# EAGLE design Nixie2nd_ver1 (EAGLE 9.6.2)
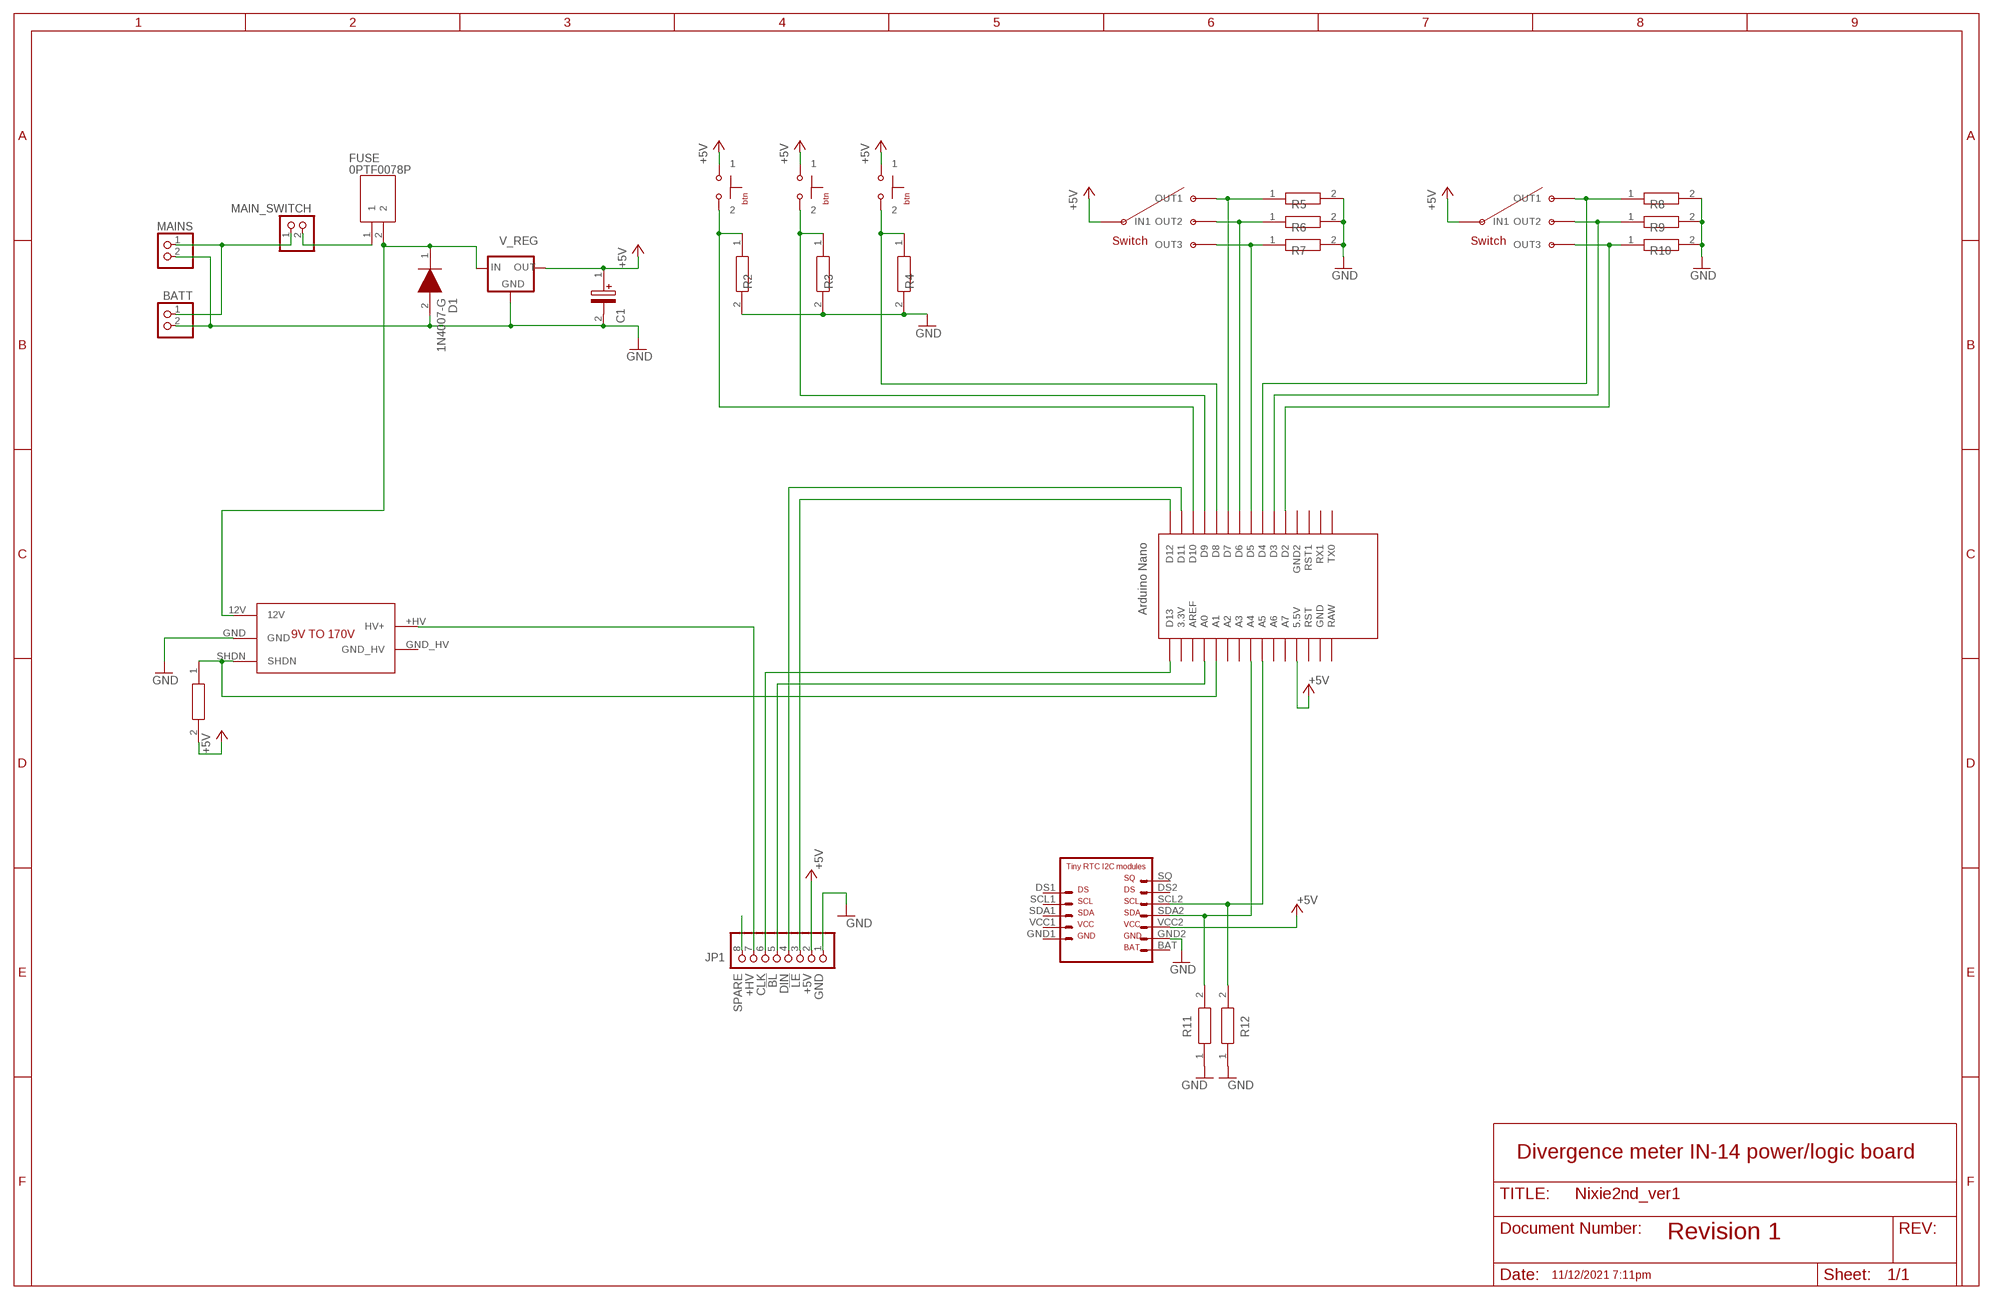
[diagram p0: schematic, sheet 1]

## Parts
BATT  PINHD-1X2  [1X02]
BTN_1  PUSH_BTN  [PUSH_BTN]
BTN_2  PUSH_BTN  [PUSH_BTN]
BTN_3  PUSH_BTN  [PUSH_BTN]
C1  ESMG250ELL330ME11D  [CAPPRD275W60D825H1300]
D1  1N4007-G  [DIOAD1410W90L470D235]
FUSE  0PTF0078P  [0PTF0078P]
JP1  PINHD-1X8  [1X08]
MAIN_SWITCH  PINHD-1X2  [1X02]
MAINS  PINHD-1X2  [1X02]
R1  CR0805-FX-3303ELF  [RESC2012X60N]
R2  CR0805-FX-3303ELF  [RESC2012X60N]
R3  CR0805-FX-3303ELF  [RESC2012X60N]
R4  CR0805-FX-3303ELF  [RESC2012X60N]
R5  CR0805-FX-3303ELF  [RESC2012X60N]
R6  CR0805-FX-3303ELF  [RESC2012X60N]
R7  CR0805-FX-3303ELF  [RESC2012X60N]
R8  CR0805-FX-3303ELF  [RESC2012X60N]
R9  CR0805-FX-3303ELF  [RESC2012X60N]
R10  CR0805-FX-3303ELF  [RESC2012X60N]
R11  CR0805-FX-3303ELF  [RESC2012X60N]
R12  CR0805-FX-3303ELF  [RESC2012X60N]
SWITCH_1  3WAY_SWITCH  [3WAY_SWITCH]
SWITCH_2  3WAY_SWITCH  [3WAY_SWITCH]
U$1  NANO  [NANO]
U$2  VOLTAGE_9TO170VOLT_9TO170  [VOLTAGE_9TO170]
U$3  RTC  [RTC]
V_REG  78XXS  [78XXS]

## Nets
!BL: JP1.5 U$1.A0
!LE: JP1.3 U$1.D12
+5V: BTN_1.1 BTN_2.1 BTN_3.1 C1.1(+) JP1.2 R1.2 SWITCH_1.IN1 SWITCH_2.IN1 U$1.5V(5.5V) U$3.VCC2 V_REG.OUT
+HV: JP1.7 U$2.+HV(HV+)
CLK: JP1.6 U$1.D13
DIN: JP1.4 U$1.D11
GND: BATT.2 C1.2(-) D1.2(A) JP1.1 MAINS.2 R2.2 R3.2 R4.2 R5.2 R6.2 R7.2 R8.2 R9.2 R10.2 R11.1 R12.1 U$2.GND U$3.GND2 V_REG.GND
MAINS: BATT.1 MAIN_SWITCH.1 MAINS.1
MAINS_REG: D1.1(K) FUSE.2 U$2.12V V_REG.IN
N$1: R5.1 SWITCH_1.OUT1 U$1.D7
N$2: R6.1 SWITCH_1.OUT2 U$1.D6
N$3: R7.1 SWITCH_1.OU3(OUT3) U$1.D5
N$4: R8.1 SWITCH_2.OUT1 U$1.D4
N$5: R9.1 SWITCH_2.OUT2 U$1.D3
N$6: R10.1 SWITCH_2.OU3(OUT3) U$1.D2
N$7: BTN_3.2 R4.1 U$1.D8
N$8: BTN_2.2 R3.1 U$1.D9
N$9: BTN_1.2 R2.1 U$1.D10
N$15: FUSE.1 MAIN_SWITCH.2
SCL: R12.2 U$1.A5 U$3.SCL2
SDA: R11.2 U$1.A4 U$3.SDA2
SHDN: R1.1 U$1.A1 U$2.SHDN
SPARE: JP1.8
Unconnected: U$1.3.3V U$1.A2 U$1.A3 U$1.A6 U$1.A7 U$1.AREF U$1.GND U$1.GND1(GND2) U$1.RAW U$1.RST U$1.RST1 U$1.RX1 U$1.TX0 U$2.GND_HV U$3.BAT U$3.DS1 U$3.DS2 U$3.GND1 U$3.SCL1 U$3.SDA1 U$3.SQ U$3.VCC1

## Notes on the sheet
- Divergence meter IN-14 power/logic board
- Revision 1
- 11/12/2021 7:11pm

## Library data of the parts
BATT MAIN_SWITCH MAINS = pinhead:PINHD-1X2: PIN HEADER
BTN_1-BTN_3 = my_libary:PUSH_BTN
C1 = SamacSys_Parts:ESMG250ELL330ME11D: Aluminium Electrolytic Capacitors - Radial Leaded 33uF 25 Volt Source: Datasheet <https://componentsearchengine.com/Datasheets/1/ESMG250ELL330ME11D.pdf>; DESCRIPTION: Aluminium Electrolytic Capacitors - Radial Leaded 33uF 25 Volt; HEIGHT: 13mm; MANUFACTURER_NAME: United Chemi-Con; MANUFACTURER_PART_NUMBER: ESMG250ELL330ME11D; MOUSER_PART_NUMBER: 661-ESMG250L330ME11D; MOUSER_PRICE-STOCK: https://www.mouser.com/Search/Refine.aspx?Keyword=661-ESMG250L330ME11D
D1 = SamacSys_Parts:1N4007-G: Rectifiers 1A 1000V Source: Datasheet <https://datasheet.datasheetarchive.com/originals/distributors/Datasheets-DGA23/1390217.pdf>; DESCRIPTION: Rectifiers 1A 1000V; HEIGHT: mm; MANUFACTURER_NAME: Comchip Technology; MANUFACTURER_PART_NUMBER: 1N4007-G; MOUSER_PART_NUMBER: 750-1N4007-G; MOUSER_PRICE-STOCK: https://www.mouser.co.uk/ProductDetail/Comchip-Technology/1N4007-G?qs=2qJf6qQ4IOKzApuByvlhjQ%3D%3D
FUSE = SamacSys_Parts:0PTF0078P: FUSEHOLDER-OPEN 5X20MM UL94V0 PITCH 22/6 Source: Datasheet <https://media.digikey.com/pdf/Data Sheets/Littelfuse PDFs/PTF075_77_78.pdf>; DESCRIPTION: FUSEHOLDER-OPEN 5X20MM UL94V0 PITCH 22/6; HEIGHT: 11.5mm; MANUFACTURER_NAME: LITTELFUSE; MANUFACTURER_PART_NUMBER: 0PTF0078P; MOUSER_PART_NUMBER: 576-0PTF0078P; MOUSER_PRICE-STOCK: https://www.mouser.co.uk/ProductDetail/Littelfuse/0PTF0078P?qs=Co4VkB5J4%2Fsczy6gG8s%2FsA%3D%3D
JP1 = pinhead:PINHD-1X8: PIN HEADER
R1-R12 = SamacSys_Parts:CR0805-FX-3303ELF: Thick Film Resistors - SMD 330K 1%.330 kOhms +/-1% 0.125W, 1/8W Chip Resistor 0805 (2012 Metric) Moisture Resistant Thick Film Source: Datasheet <https://www.bourns.com/pdfs/chpreztr.pdf>; DESCRIPTION: Thick Film Resistors - SMD 330K 1%.330 kOhms +/-1% 0.125W, 1/8W Chip Resistor 0805 (2012 Metric) Moisture Resistant Thick Film; HEIGHT: 0.6mm; MANUFACTURER_NAME: Bourns; MANUFACTURER_PART_NUMBER: CR0805-FX-3303ELF; MOUSER_PART_NUMBER: 652-CR0805FX-3303ELF; MOUSER_PRICE-STOCK: https://www.mouser.co.uk/ProductDetail/Bourns/CR0805-FX-3303ELF?qs=4vGXhLEMbUy26Aiok5H%252BVw%3D%3D
SWITCH_1 SWITCH_2 = my_libary:3WAY_SWITCH
U$1 = Arduino-clone:NANO: Arduino Nano
U$2 = my_libary:VOLTAGE_9TO170
U$3 = RTC_I2C:RTC
V_REG = v-reg:78XXS: VOLTAGE REGULATOR

## Board
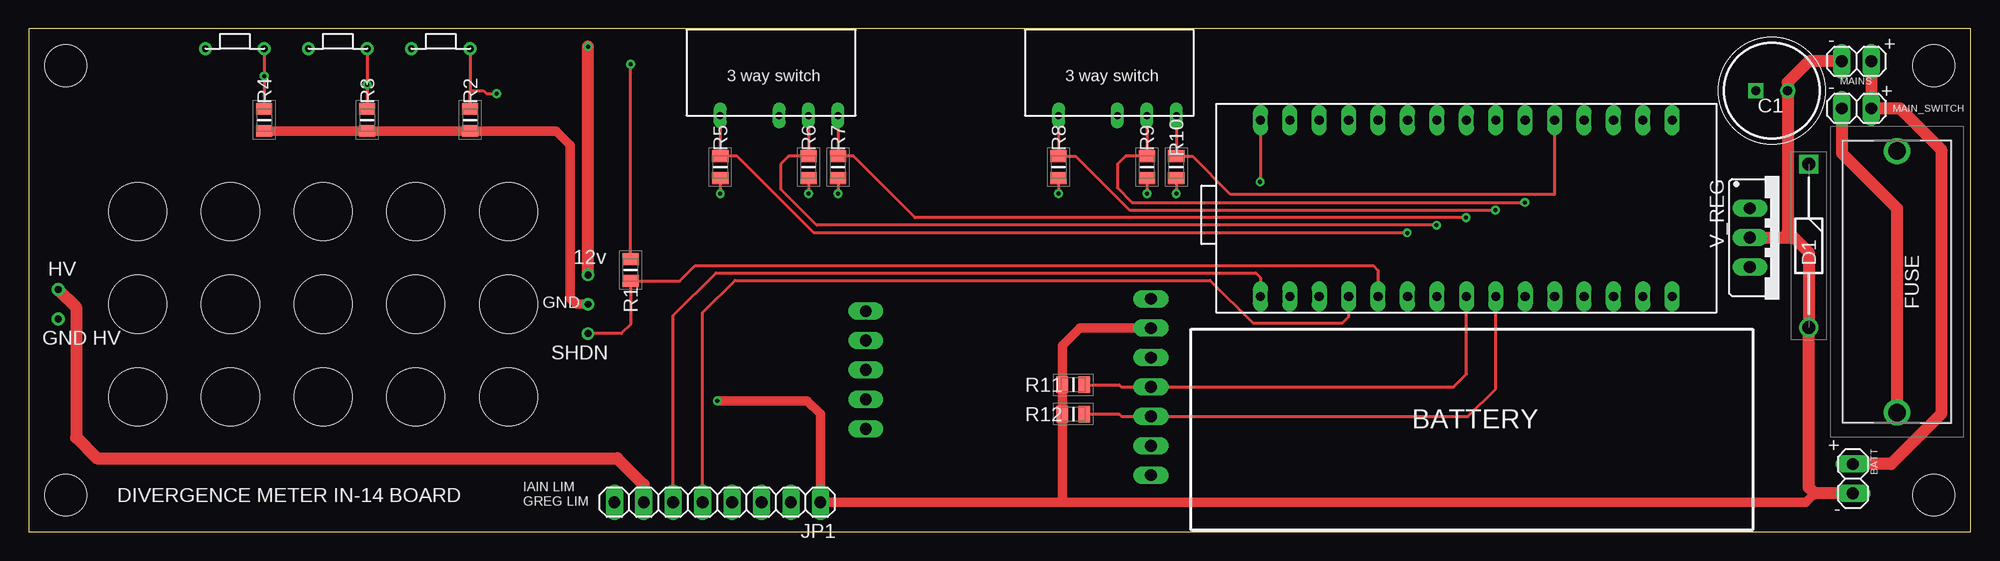
[diagram p1: board, top side]
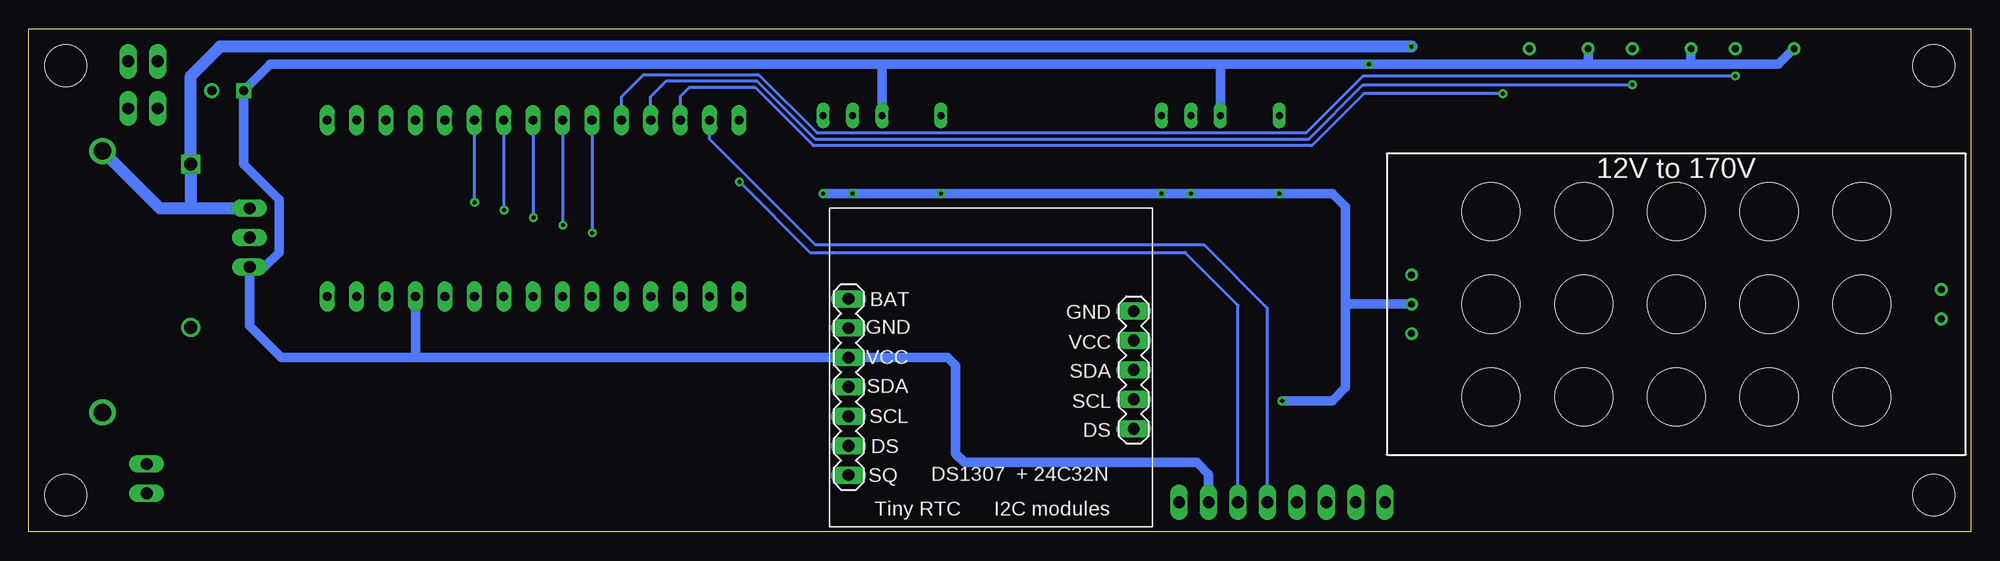
[diagram p2: board, bottom side, seen from below]

Size 167.64 x 43.43 mm. Coordinates in mm from the lower left corner, seen from the top.
Outline: 0,0 167.64,0 167.64,43.43 0,43.43 0,0
Copper layers (1*16): Top 0.035mm / dielectric 1.5mm / Bottom 0.035mm
Design rules "default": minimum track width 6mil, minimum drill 0.35mm, track to track 6mil, track to pad 6mil, pad to pad 6mil, via to via 6mil, smd to smd 6mil, copper to edge 40mil, drill to drill 6mil, minimum pad ring 10mil, minimum via ring 8mil, stop-mask expansion 4mil, vias tented up to drill 0mil, thermal gap 10mil
Holes 3.58 mm at 3.17,3.17 3.17,40.26 164.47,40.26 164.47,3.17

### Footprints (pad centres in the part's own frame; a part is rotated, then mirrored left to right if it is on the bottom)
1X02 = drill 1.016 long: 1 -1.27,0; 2 1.27,0
PUSH_BTN = drill 0.6: 1 -2.54,0; 2 2.54,0
CAPPRD275W60D825H1300 = drill 0.8 pad 1.2 square: 1 0,0 | drill 0.8 pad 1.2: 2 2.75,0
DIOAD1410W90L470D235 = drill 1.1 pad 1.65 square: 1 0,0 | drill 1.1 pad 1.65: 2 14.1,0
0PTF0078P = drill 1.5 pad 2.25: 1 -11.3,0; 2 11.3,0
1X08 = drill 1.016 long: 1 -8.89,0; 2 -6.35,0; 3 -3.81,0; 4 -1.27,0; 5 1.27,0; 6 3.81,0; 7 6.35,0; 8 8.89,0
RESC2012X60N = smd 1 x 1.4: 1 -0.95,0; 2 0.95,0
3WAY_SWITCH = drill 0.6 long: IN1 0,-7.4; OU3 5.08,-7.4; OUT1 -5.08,-7.4; OUT2 2.54,-7.4
NANO = drill 0.8 long: 3.3V -10.16,24.13; 5V -10.16,-1.27; A0 -10.16,19.05; A1 -10.16,16.51; A2 -10.16,13.97; A3 -10.16,11.43; A4 -10.16,8.89; A5 -10.16,6.35; A6 -10.16,3.81; A7 -10.16,1.27; AREF -10.16,21.59; D2 5.08,1.27; D3 5.08,3.81; D4 5.08,6.35; D5 5.08,8.89; D6 5.08,11.43; D7 5.08,13.97; D8 5.08,16.51; D9 5.08,19.05; D10 5.08,21.59; D11 5.08,24.13; D12 5.08,26.67; D13 -10.16,26.67; GND -10.16,-6.35; GND1 5.08,-1.27; RAW -10.16,-8.89; RST -10.16,-3.81; RST1 5.08,-3.81; RX1 5.08,-6.35; TX0 5.08,-8.89
VOLTAGE_9TO170 = drill 0.6: 12V 2.14,15.54; +HV 47.86,14.27; GND 2.14,13; GND_HV 47.86,11.73; SHDN 2.14,10.46 | hole 5: 9,5; 17,5; 25,5; 33,5; 9,21; 17,21; 25,21; 33,21; 9,13; 17,13; 25,13; 33,13; 41,5; 41,21; 41,13
RTC = drill 1.016 long: BAT 25.75,7.82; DS1 1.13,19.05; DS2 25.75,20.52; GND1 1.13,8.89; GND2 25.75,10.36; SCL1 1.13,16.51; SCL2 25.75,17.98; SDA1 1.13,13.97; SDA2 25.75,15.44; SQ 25.75,23.06; VCC1 1.13,11.43; VCC2 25.75,12.9
78XXS = drill 1.016 long: GND 0,-2.54; IN -2.54,-2.54; OUT 2.54,-2.54

### Placement (x,y rotation side)
BATT  157.48,4.57 270 top
BTN_1  35.56,41.73 0 top
BTN_2  26.67,41.73 0 top
BTN_3  17.78,41.73 0 top
C1  149.1,38.1 0 top
D1  153.67,31.75 270 top
FUSE  161.29,21.59 90 top
JP1  59.44,2.54 180 top
MAIN_SWITCH  157.8,36.58 180 top
MAINS  157.8,40.64 180 top
R1  51.94,22.61 90 top
R2  38.1,35.56 270 top
R3  29.21,35.56 270 top
R4  20.32,35.56 270 top
R5  59.69,31.5 270 top
R6  67.31,31.5 270 top
R7  69.85,31.5 270 top
R8  88.9,31.5 270 top
R9  96.52,31.5 270 top
R10  99.06,31.5 270 top
R11  90.17,12.7 0 top
R12  90.17,10.16 0 top
SWITCH_1  64.77,43.35 0 top
SWITCH_2  93.98,43.35 0 top
U$1  133,30.48 90 top
U$2  50.4,6.65 0 bottom
U$3  71.12,27.94 180 bottom
V_REG  151.13,25.4 270 top

### Tracks (layer width: path | path; a pad name or v marks a point on that pad's centre or on a via)
!BL
  Top 0.254: JP1.5 58.17,18.92 60.96,21.72 101.98,21.72 105.66,18.03 113.41,18.03 113.95,18.57 U$1.A0
!LE  (via drill 0.35)
  Top 0.254: U$1.D12 106.33,30.26 v106.3,30.23
  Bottom 0.254: v106.3,30.23 100.2,24.13 67.82,24.13 63.25,19.56 JP1.3
+5V  (via drill 0.35)
  Top 0.254: R1.2 v51.94,40.39
  Bottom 0.813: BTN_3.1 16.59,40.39 24.13,40.39 | 33.02,40.39 24.13,40.39 | 64.77,40.39 93.98,40.39 | 93.98,40.39 146.81,40.39 C1.1 149.1,31.75 146.05,28.7 146.05,24.13 147.32,22.86 V_REG.OUT 148.59,17.78 145.85,15.04 134.24,15.04 | SWITCH_2.IN1 93.98,40.39 | SWITCH_1.IN1 64.77,40.39 | BTN_2.1 24.13,40.39 | BTN_1.1 33.02,40.39 | 33.02,40.39 v51.94,40.39 64.77,40.39 | 134.24,15.04 U$3.VCC2 88.32,15.04 87.63,14.35 87.63,6.73 86.87,5.97 66.8,5.97 65.79,4.95 JP1.2 | U$1.5V 134.27,15.07 134.24,15.04
+HV
  Top 1.016: JP1.7 53.09,4.06 50.8,6.35 5.84,6.35 4.06,8.13 4.06,19.4 U$2.+HV
CLK
  Top 0.254: JP1.6 55.63,18.67 59.31,22.35 105.92,22.35 106.33,21.94 U$1.D13
DIN
  Bottom 0.254: JP1.4 60.71,19.3 66.17,24.77 99.73,24.77 108.87,33.91 U$1.D11
GND  (via drill 0.35)
  Top 0.254: R5.2 v59.69,29.21 | R10.2 v99.06,29.21 | R6.2 v67.31,29.21 | R7.2 v69.85,29.21 | R8.2 v88.9,29.21 | R9.2 v96.52,29.21
  Top 0.813: 154.18,3.3 153.42,2.54 89.15,2.54 | 89.15,2.54 JP1.1 68.33,10.16 67.18,11.3 v59.44,11.3 | U$3.GND2 90.73,17.58 89.22,16.07 R11.1 R12.1 89.22,2.61 89.15,2.54 | R4.2 R3.2 R2.2 45.53,34.61 46.74,33.4 46.74,20.19 47.28,19.65 U$2.GND
  Top 1.016: BATT.2 154.18,3.3 153.67,3.81 D1.2 153.67,24.13 152.4,25.4 | V_REG.GND 152.4,25.4 | MAINS.2 153.67,40.64 151.85,38.82 C1.2 151.85,25.95 152.4,25.4
  Bottom 0.813: v99.06,29.21 v96.52,29.21 v88.9,29.21 v69.85,29.21 v67.31,29.21 v59.69,29.21 55.12,29.21 53.98,28.07 53.98,19.68 | v59.44,11.3 55.12,11.3 53.98,12.45 53.98,19.68 | U$2.GND 53.94,19.65 53.98,19.68
MAINS
  Top 1.016: MAINS.1 MAIN_SWITCH.1 161.54,36.58 165.1,33.02 165.1,10.16 160.78,5.84 BATT.1
MAINS_REG  (via drill 0.35)
  Top 1.016: U$2.12V v48.26,41.91
  Bottom 1.016: FUSE.2 156.34,27.94 153.67,27.94 | 153.67,27.94 V_REG.IN | 153.67,27.94 D1.1 153.67,39.37 151.13,41.91 v48.26,41.91
N$1  (via drill 0.35)
  Top 0.254: SWITCH_1.OUT1 R5.1 61.15,32.45 67.78,25.82 v119,25.82
  Bottom 0.254: U$1.D7 119.03,25.85 v119,25.82
N$2  (via drill 0.35)
  Top 0.254: SWITCH_1.OUT2 R6.1 65.59,32.45 64.9,31.75 64.9,29.59 68.01,26.48 v121.54,26.48
  Bottom 0.254: U$1.D6 121.57,26.51 v121.54,26.48
N$3  (via drill 0.35)
  Top 0.254: SWITCH_1.OU3 R7.1 71.19,32.45 76.5,27.13 v124.08,27.13
  Bottom 0.254: U$1.D5 124.11,27.16 v124.08,27.13
N$4  (via drill 0.35)
  Top 0.254: SWITCH_2.OUT1 R8.1 90.36,32.45 95.02,27.79 v126.62,27.79
  Bottom 0.254: v126.62,27.79 126.62,35.53 U$1.D4
N$5  (via drill 0.35)
  Top 0.254: SWITCH_2.OUT2 R9.1 94.68,32.45 93.98,31.75 93.98,29.72 95.25,28.45 v129.16,28.45
  Bottom 0.254: v129.16,28.45 129.16,35.53 U$1.D3
N$6
  Top 0.254: SWITCH_2.OU3 R10.1 100.46,32.45 103.76,29.14 131.73,29.14 U$1.D2
N$7  (via drill 0.35)
  Top 0.254: BTN_3.2 v20.32,39.37 R4.1
  Bottom 0.254: v20.32,39.37 52.45,39.37 57.4,34.42 99.57,34.42 104.65,39.5 114.55,39.5 116.49,37.56 U$1.D8
N$8  (via drill 0.35)
  Top 0.254: BTN_2.2 v29.21,38.61 R3.1
  Bottom 0.254: v29.21,38.61 52.45,38.61 57.17,33.88 99.74,33.88 104.81,38.96 112.59,38.96 113.95,37.59 U$1.D9
N$9  (via drill 0.35)
  Top 0.254: BTN_1.2 38.1,38.1 | R2.1 38.1,38.1 | 38.1,38.1 39.24,38.1 39.5,37.85 v40.39,37.85
  Bottom 0.254: v40.39,37.85 52.38,37.85 56.88,33.35 99.9,33.35 104.9,38.35 110.65,38.35 111.41,37.59 U$1.D10
N$15
  Top 1.016: MAIN_SWITCH.2 156.53,32.7 161.29,27.94 FUSE.1
SCL
  Top 0.254: R12.2 94.13,10.16 94.33,9.96 U$3.SCL2 124.26,9.96 126.65,12.35 U$1.A5
SDA
  Top 0.254: R11.2 94.13,12.7 94.33,12.5 U$3.SDA2 122.99,12.5 124.11,13.62 U$1.A4
SHDN
  Top 0.254: R1.1 51.92,21.62 | R1.1 56.2,21.65 57.53,22.99 116.08,22.99 116.49,22.57 U$1.A1 | R1.1 51.94,17.91 51.15,17.11 U$2.SHDN

### Text on the board
tNames: - | + | - | + | 12v | HV | GND | GND HV | SHDN | BATTERY | + | DIVERGENCE METER IN-14 BOARD | IAIN LIM / GREG LIM | -